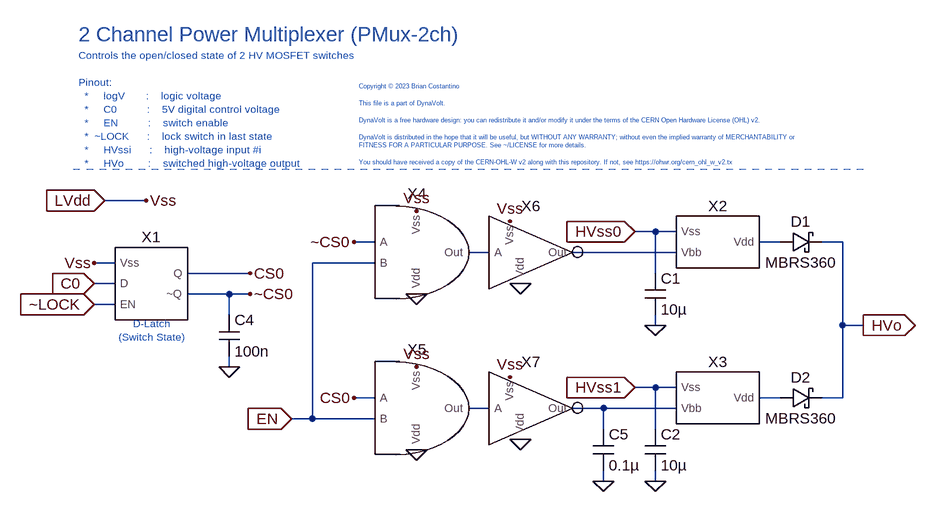
[diagram p0: schematic PMux-2ch.asc]
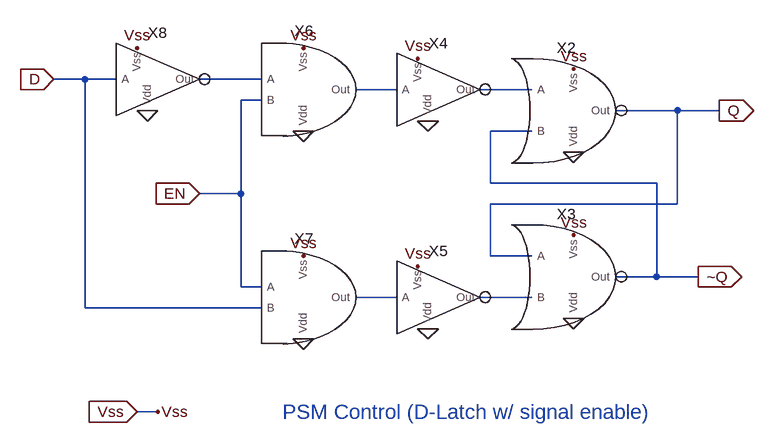
[diagram p1: sub-circuit cmos_dlatch.asc]
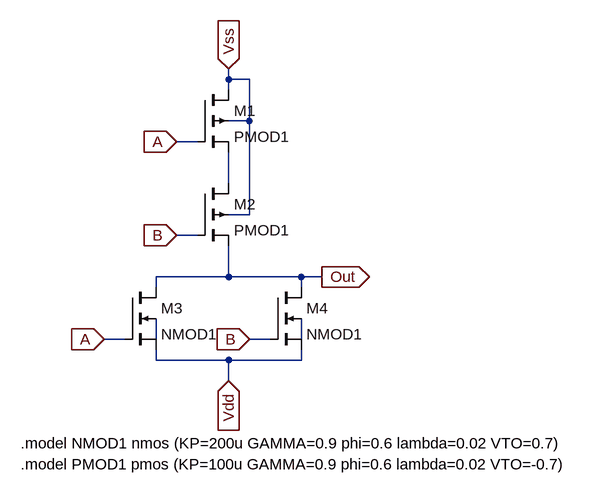
[diagram p2: sub-circuit cmos_nor.asc]
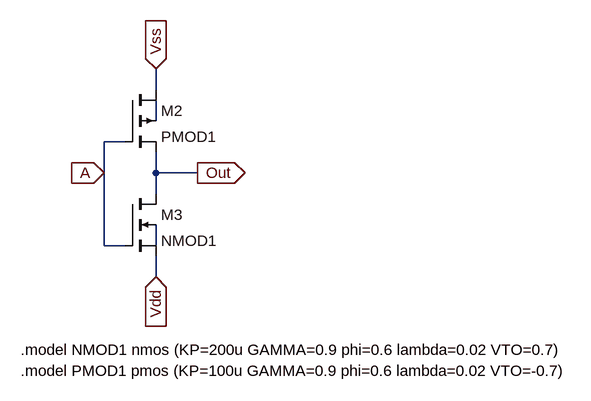
[diagram p3: sub-circuit cmos_inv.asc]
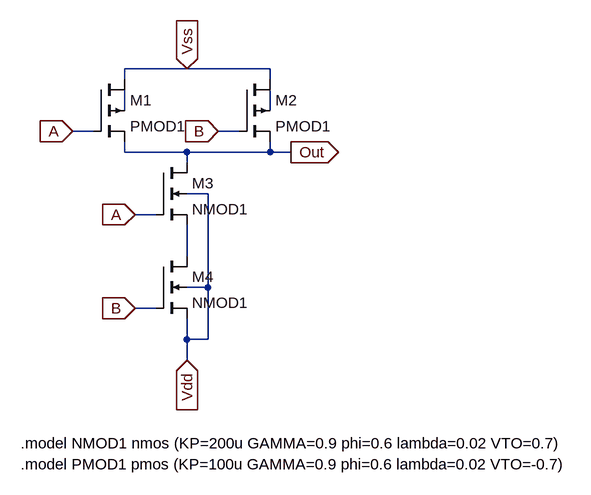
[diagram p4: sub-circuit cmos_nand.asc]
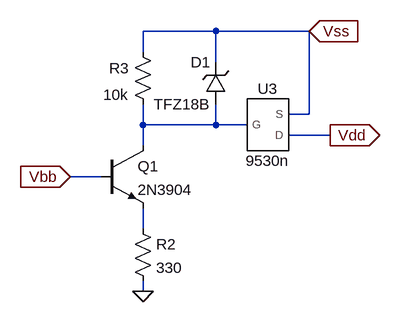
[diagram p5: sub-circuit 9530n_pmos_hss.asc]
PMux-2ch.asc, the LTspice schematic file:
Version 4
SHEET 1 2588 1108
WIRE -224 -32 -288 -32
WIRE 560 16 528 16
WIRE 592 16 560 16
WIRE 128 32 96 32
WIRE 752 32 720 32
WIRE 848 32 816 32
WIRE 304 48 272 48
WIRE 592 48 432 48
WIRE -272 64 -304 64
WIRE 128 64 32 64
WIRE -64 80 -160 80
WIRE 560 80 560 16
WIRE -272 96 -304 96
WIRE -96 112 -160 112
WIRE -64 112 -96 112
WIRE -272 128 -304 128
WIRE -96 144 -96 112
WIRE 560 160 560 144
WIRE 848 160 848 32
WIRE 880 160 848 160
WIRE -96 224 -96 208
WIRE 560 256 528 256
WIRE 592 256 560 256
WIRE 128 272 96 272
WIRE 752 272 720 272
WIRE 848 272 848 160
WIRE 848 272 816 272
WIRE 304 288 272 288
WIRE 480 288 432 288
WIRE 592 288 480 288
WIRE 32 304 32 64
WIRE 32 304 0 304
WIRE 128 304 32 304
WIRE 480 320 480 288
WIRE 560 320 560 256
WIRE 480 400 480 384
WIRE 560 400 560 384
FLAG -224 -32 Vss
FLAG -288 -32 LVdd
IOPIN -288 -32 In
FLAG -304 128 ~LOCK
IOPIN -304 128 In
FLAG -64 80 CS0
FLAG 528 16 HVss0
IOPIN 528 16 In
FLAG -304 96 C0
IOPIN -304 96 In
FLAG 560 400 0
FLAG 528 256 HVss1
IOPIN 528 256 In
FLAG 880 160 HVo
IOPIN 880 160 Out
FLAG -64 112 ~CS0
FLAG 96 272 CS0
FLAG 192 -16 Vss
FLAG 192 112 0
FLAG 0 304 EN
IOPIN 0 304 In
FLAG 96 32 ~CS0
FLAG 192 224 Vss
FLAG 192 352 0
FLAG 352 96 0
FLAG 352 336 0
FLAG 336 0 Vss
FLAG 336 240 Vss
FLAG -96 224 0
FLAG 560 160 0
FLAG 480 400 0
FLAG -304 64 Vss
SYMBOL cap 544 320 R0
SYMATTR InstName C2
SYMATTR Value 10µ
SYMBOL schottky 752 288 R270
WINDOW 0 32 32 VTop 2
WINDOW 3 0 32 VBottom 2
SYMATTR InstName D2
SYMATTR Value MBRS360
SYMATTR Description Diode
SYMATTR Type diode
SYMBOL schottky 752 48 R270
WINDOW 0 32 32 VTop 2
WINDOW 3 0 32 VBottom 2
SYMATTR InstName D1
SYMATTR Value MBRS360
SYMATTR Description Diode
SYMATTR Type diode
SYMBOL cap -112 144 R0
SYMATTR InstName C4
SYMATTR Value 100n
SYMBOL cap 544 80 R0
SYMATTR InstName C1
SYMATTR Value 10µ
SYMBOL cap 464 320 R0
SYMATTR InstName C5
SYMATTR Value 0.1µ
SYMBOL CMOS_DLATCH -224 96 R0
SYMATTR InstName X1
SYMBOL 9530n_PMOS_HSS 656 32 R0
SYMATTR InstName X2
SYMBOL 9530n_PMOS_HSS 656 272 R0
SYMATTR InstName X3
SYMBOL CMOS_NAND 192 48 R0
SYMATTR InstName X4
SYMBOL CMOS_NAND 192 288 R0
SYMATTR InstName X5
SYMBOL CMOS_INV 368 48 R0
SYMATTR InstName X6
SYMBOL CMOS_INV 368 288 R0
SYMATTR InstName X7
TEXT -328 -288 Left 3 ;2 Channel Power Multiplexer (PMux-2ch)
TEXT -328 -256 Left 1 ;Controls the open/closed state of 2 HV MOSFET switches\n \nPinout:\n  *     logV       :    logic voltage\n  *     C0          :    5V digital control voltage\n  *     EN          :    switch enable\n  *  ~LOCK      :    lock switch in last state\n  *     HVssi      :    high-voltage input #i\n  *     HVo        :    switched high-voltage output
TEXT -216 168 Center 1 ;D-Latch\n(Switch State)
TEXT 104 -208 Left 0 ;Copyright © 2023 Brian Costantino\n \nThis file is a part of DynaVolt.\n \nDynaVolt is a free hardware design: you can redistribute it and/or modify it under the terms of the CERN Open Hardware License (OHL) v2.\n \nDynaVolt is distributed in the hope that it will be useful, but WITHOUT ANY WARRANTY; without even the implied warranty of MERCHANTABILITY or \nFITNESS FOR A PARTICULAR PURPOSE. See ~/LICENSE for more details.\n \nYou should have received a copy of the CERN-OHL-W v2 along with this repository. If not, see https://ohwr.org/cern_ohl_w_v2.tx
LINE Normal 880 -80 -336 -80 2

cmos_dlatch.asc, the sub-circuit schematic file:
Version 4
SHEET 1 1588 680
WIRE -432 -480 -480 -480
WIRE -384 -480 -432 -480
WIRE -160 -480 -256 -480
WIRE 48 -464 -16 -464
WIRE 256 -464 176 -464
WIRE -160 -448 -192 -448
WIRE 480 -432 384 -432
WIRE 544 -432 480 -432
WIRE 256 -400 192 -400
WIRE 192 -320 192 -400
WIRE 448 -320 192 -320
WIRE -192 -304 -192 -448
WIRE -192 -304 -256 -304
WIRE 480 -288 480 -432
WIRE 480 -288 192 -288
WIRE 192 -208 192 -288
WIRE 256 -208 192 -208
WIRE 448 -176 448 -320
WIRE 448 -176 384 -176
WIRE 512 -176 448 -176
WIRE -192 -160 -192 -304
WIRE -160 -160 -192 -160
WIRE 48 -144 -16 -144
WIRE 256 -144 176 -144
WIRE -432 -128 -432 -480
WIRE -160 -128 -432 -128
WIRE -320 32 -352 32
FLAG -320 32 Vss
FLAG 544 -432 Q
IOPIN 544 -432 Out
FLAG 320 -496 Vss
FLAG 320 -240 Vss
FLAG 80 -192 Vss
FLAG 80 -512 Vss
FLAG 320 -368 0
FLAG 320 -112 0
FLAG 96 -96 0
FLAG 96 -416 0
FLAG -96 -400 0
FLAG -96 -528 Vss
FLAG -96 -80 0
FLAG -96 -208 Vss
FLAG -352 -528 Vss
FLAG -336 -432 0
FLAG -256 -304 EN
IOPIN -256 -304 In
FLAG -480 -480 D
IOPIN -480 -480 In
FLAG -352 32 Vss
IOPIN -352 32 In
FLAG 512 -176 ~Q
IOPIN 512 -176 Out
SYMBOL Custom\\Logic\\CMOS_NOR 304 -432 R0
SYMATTR InstName X2
SYMBOL Custom\\Logic\\CMOS_NOR 304 -176 R0
SYMATTR InstName X3
SYMBOL Custom\\Logic\\CMOS_INV 112 -464 R0
SYMATTR InstName X4
SYMBOL Custom\\Logic\\CMOS_INV 112 -144 R0
SYMATTR InstName X5
SYMBOL Custom\\Logic\\CMOS_NAND -96 -464 R0
SYMATTR InstName X6
SYMBOL Custom\\Logic\\CMOS_NAND -96 -144 R0
SYMATTR InstName X7
SYMBOL Custom\\Logic\\CMOS_INV -320 -480 R0
SYMATTR InstName X8
TEXT -128 32 Left 3 ;PSM Control (D-Latch w/ signal enable)

cmos_nor.asc, the sub-circuit schematic file:
Version 4
SHEET 1 880 680
WIRE 208 48 208 32
WIRE 240 48 208 48
WIRE 208 64 208 48
WIRE 240 112 240 48
WIRE 240 112 208 112
WIRE 160 144 128 144
WIRE 208 208 208 160
WIRE 240 256 240 112
WIRE 240 256 208 256
WIRE 160 288 128 288
WIRE 208 352 208 304
WIRE 208 352 96 352
WIRE 320 352 208 352
WIRE 352 352 320 352
WIRE 96 368 96 352
WIRE 320 368 320 352
WIRE 48 448 16 448
WIRE 96 448 96 416
WIRE 272 448 240 448
WIRE 320 448 320 416
WIRE 96 480 96 464
WIRE 208 480 96 480
WIRE 320 480 320 464
WIRE 320 480 208 480
WIRE 208 512 208 480
FLAG 208 32 Vss
IOPIN 208 32 In
FLAG 208 512 Vdd
IOPIN 208 512 In
FLAG 16 448 A
IOPIN 16 448 In
FLAG 128 144 A
IOPIN 128 144 In
FLAG 240 448 B
IOPIN 240 448 In
FLAG 128 288 B
IOPIN 128 288 In
FLAG 352 352 Out
IOPIN 352 352 Out
SYMBOL nmos4 48 368 R0
SYMATTR InstName M3
SYMATTR Value NMOD1
SYMATTR Value2 l=1u w=25u
SYMBOL nmos4 272 368 R0
SYMATTR InstName M4
SYMATTR Value NMOD1
SYMATTR Value2 l=1u w=25u
SYMBOL pmos4 160 64 R0
SYMATTR InstName M1
SYMATTR Value PMOD1
SYMATTR Value2 l=1u w=100u
SYMBOL pmos4 160 208 R0
SYMATTR InstName M2
SYMATTR Value PMOD1
SYMATTR Value2 l=1u w=100u
TEXT -112 640 Left 2 !.model PMOD1 pmos (KP=100u GAMMA=0.9 phi=0.6 lambda=0.02 VTO=-0.7)
TEXT -112 608 Left 2 !.model NMOD1 nmos (KP=200u GAMMA=0.9 phi=0.6 lambda=0.02 VTO=0.7)

cmos_inv.asc, the sub-circuit schematic file:
Version 4
SHEET 1 880 680
WIRE 96 208 96 176
WIRE 96 256 96 224
WIRE 48 288 16 288
WIRE 16 336 16 288
WIRE 96 336 96 304
WIRE 160 336 96 336
WIRE 96 368 96 336
WIRE 16 448 16 336
WIRE 48 448 16 448
WIRE 96 448 96 416
WIRE 96 496 96 464
FLAG 96 176 Vss
IOPIN 96 176 In
FLAG 96 496 Vdd
IOPIN 96 496 In
FLAG 16 336 A
IOPIN 16 336 In
FLAG 160 336 Out
IOPIN 160 336 Out
SYMBOL nmos4 48 368 R0
SYMATTR InstName M3
SYMATTR Value NMOD1
SYMATTR Value2 l=1u w=25u
SYMBOL pmos4 48 208 R0
SYMATTR InstName M2
SYMATTR Value PMOD1
SYMATTR Value2 l=1u w=100u
TEXT -112 640 Left 2 !.model PMOD1 pmos (KP=100u GAMMA=0.9 phi=0.6 lambda=0.02 VTO=-0.7)
TEXT -112 608 Left 2 !.model NMOD1 nmos (KP=200u GAMMA=0.9 phi=0.6 lambda=0.02 VTO=0.7)

cmos_nand.asc, the sub-circuit schematic file:
Version 4
SHEET 1 880 680
WIRE 144 32 48 32
WIRE 272 32 144 32
WIRE 48 48 48 32
WIRE 272 48 272 32
WIRE 48 96 48 64
WIRE 272 96 272 64
WIRE 0 128 -32 128
WIRE 224 128 192 128
WIRE 48 160 48 144
WIRE 144 160 48 160
WIRE 272 160 272 144
WIRE 272 160 144 160
WIRE 304 160 272 160
WIRE 144 176 144 160
WIRE 176 224 144 224
WIRE 96 256 64 256
WIRE 144 320 144 272
WIRE 176 368 176 224
WIRE 176 368 144 368
WIRE 96 400 64 400
WIRE 144 448 144 416
WIRE 176 448 176 368
WIRE 176 448 144 448
WIRE 144 480 144 448
FLAG 144 32 Vss
IOPIN 144 32 In
FLAG 144 480 Vdd
IOPIN 144 480 In
FLAG -32 128 A
IOPIN -32 128 In
FLAG 64 256 A
IOPIN 64 256 In
FLAG 192 128 B
IOPIN 192 128 In
FLAG 64 400 B
IOPIN 64 400 In
FLAG 304 160 Out
IOPIN 304 160 Out
SYMBOL nmos4 96 176 R0
SYMATTR InstName M3
SYMATTR Value NMOD1
SYMATTR Value2 l=1u w=50u
SYMBOL nmos4 96 320 R0
SYMATTR InstName M4
SYMATTR Value NMOD1
SYMATTR Value2 l=1u w=50u
SYMBOL pmos4 0 48 R0
SYMATTR InstName M1
SYMATTR Value PMOD1
SYMATTR Value2 l=1u w=50u
SYMBOL pmos4 224 48 R0
SYMATTR InstName M2
SYMATTR Value PMOD1
SYMATTR Value2 l=1u w=50u
TEXT -112 640 Left 2 !.model PMOD1 pmos (KP=100u GAMMA=0.9 phi=0.6 lambda=0.02 VTO=-0.7)
TEXT -112 608 Left 2 !.model NMOD1 nmos (KP=200u GAMMA=0.9 phi=0.6 lambda=0.02 VTO=0.7)

9530n_pmos_hss.asc, the sub-circuit schematic file:
Version 4
SHEET 1 1160 680
WIRE 48 0 -64 0
WIRE 192 0 48 0
WIRE -64 32 -64 0
WIRE 48 48 48 0
WIRE 192 128 192 0
WIRE 192 128 160 128
WIRE -64 144 -64 112
WIRE 48 144 48 112
WIRE 48 144 -64 144
WIRE 96 144 48 144
WIRE 224 160 160 160
WIRE -64 176 -64 144
WIRE -128 224 -176 224
WIRE -64 304 -64 272
WIRE -64 400 -64 384
FLAG 192 0 Vss
IOPIN 192 0 In
FLAG -176 224 Vbb
IOPIN -176 224 In
FLAG 224 160 Vdd
IOPIN 224 160 Out
FLAG -64 400 0
SYMBOL 9530n 128 144 R0
SYMATTR InstName U3
SYMBOL npn -128 176 R0
SYMATTR InstName Q1
SYMATTR Value 2N3904
SYMBOL res -80 16 R0
WINDOW 0 -36 41 Left 2
WINDOW 3 -45 82 Left 2
SYMATTR InstName R3
SYMATTR Value 10k
SYMBOL zener 64 112 R180
WINDOW 0 24 64 Left 2
WINDOW 3 24 0 Left 2
SYMATTR InstName D1
SYMATTR Value TFZ18B
SYMBOL res -80 288 R0
SYMATTR InstName R2
SYMATTR Value 330

The netlist it stands for:
* PMux-2ch.asc
C2 HVss1 0 10µ
D2 N004 HVo MBRS360
D1 N001 HVo MBRS360
C4 ~CS0 0 100n
C1 HVss0 0 10µ
C5 N006 0 0.1µ
XX1 C0 ~LOCK LVdd CS0 ~CS0 cmos_dlatch
XX2 HVss0 N003 N001 9530n_pmos_hss
XX3 HVss1 N006 N004 9530n_pmos_hss
XX4 ~CS0 EN 0 LVdd N002 cmos_nand
XX5 CS0 EN 0 LVdd N005 cmos_nand
XX6 N002 0 LVdd N003 cmos_inv
XX7 N005 0 LVdd N006 cmos_inv

* block symbol definitions
.subckt cmos_dlatch D EN Vss Q ~Q
XX2 N003 ~Q 0 Vss Q cmos_nor
XX3 Q N005 0 Vss ~Q cmos_nor
XX4 N002 0 Vss N003 cmos_inv
XX5 N004 0 Vss N005 cmos_inv
XX6 N001 EN 0 Vss N002 cmos_nand
XX7 EN D 0 Vss N004 cmos_nand
XX8 D 0 Vss N001 cmos_inv
* PSM Control (D-Latch w/ signal enable)
.ends cmos_dlatch

.subckt cmos_nor A B Vdd Vss Out
M3 Out A Vdd N002 NMOD1 l=1u w=25u
M4 Out B Vdd N003 NMOD1 l=1u w=25u
M1 Vss A N001 Vss PMOD1 l=1u w=100u
M2 N001 B Out Vss PMOD1 l=1u w=100u
.model PMOD1 pmos (KP=100u GAMMA=0.9 phi=0.6 lambda=0.02 VTO=-0.7)
.model NMOD1 nmos (KP=200u GAMMA=0.9 phi=0.6 lambda=0.02 VTO=0.7)
.ends cmos_nor

.subckt cmos_inv A Vdd Vss Out
M3 Out A Vdd N002 NMOD1 l=1u w=25u
M2 Vss A Out N001 PMOD1 l=1u w=100u
.model PMOD1 pmos (KP=100u GAMMA=0.9 phi=0.6 lambda=0.02 VTO=-0.7)
.model NMOD1 nmos (KP=200u GAMMA=0.9 phi=0.6 lambda=0.02 VTO=0.7)
.ends cmos_inv

.subckt cmos_nand A B Vdd Vss Out
M3 Out A N003 Vdd NMOD1 l=1u w=50u
M4 N003 B Vdd Vdd NMOD1 l=1u w=50u
M1 Vss A Out N001 PMOD1 l=1u w=50u
M2 Vss B Out N002 PMOD1 l=1u w=50u
.model PMOD1 pmos (KP=100u GAMMA=0.9 phi=0.6 lambda=0.02 VTO=-0.7)
.model NMOD1 nmos (KP=200u GAMMA=0.9 phi=0.6 lambda=0.02 VTO=0.7)
.ends cmos_nand

.subckt 9530n_pmos_hss Vss Vbb Vdd
XU3 Vdd N001 Vss 9530n  ; pins D G S
Q1 N001 Vbb N002 0 2N3904
R3 Vss N001 10k
D1 N001 Vss TFZ18B
R2 N002 0 330
.ends 9530n_pmos_hss

.model D D
.lib standard.dio
.model NPN NPN
.model PNP PNP
.lib standard.bjt
.model NMOS NMOS
.model PMOS PMOS
.lib standard.mos
* 2 Channel Power Multiplexer (PMux-2ch)
* Controls the open/closed state of 2 HV MOSFET switches
* Pinout:
*   *     logV       :    logic voltage
*   *     C0          :    5V digital control voltage
*   *     EN          :    switch enable
*   *  ~LOCK      :    lock switch in last state
*   *     HVssi      :    high-voltage input #i
*   *     HVo        :    switched high-voltage output
* D-Latch
* (Switch State)
* Copyright © 2023 Brian Costantino
* This file is a part of DynaVolt.
* DynaVolt is a free hardware design: you can redistribute it and/or modify it under the terms of the CERN Open Hardware License (OHL) v2.
* DynaVolt is distributed in the hope that it will be useful, but WITHOUT ANY WARRANTY; without even the implied warranty of MERCHANTABILITY or
* FITNESS FOR A PARTICULAR PURPOSE. See ~/LICENSE for more details.
* You should have received a copy of the CERN-OHL-W v2 along with this repository. If not, see https://ohwr.org/cern_ohl_w_v2.tx
.lib 9530n.spi
.backanno
.end